# Altium project e-puck3-motor_dev.PrjPcb (part 1 of 2)
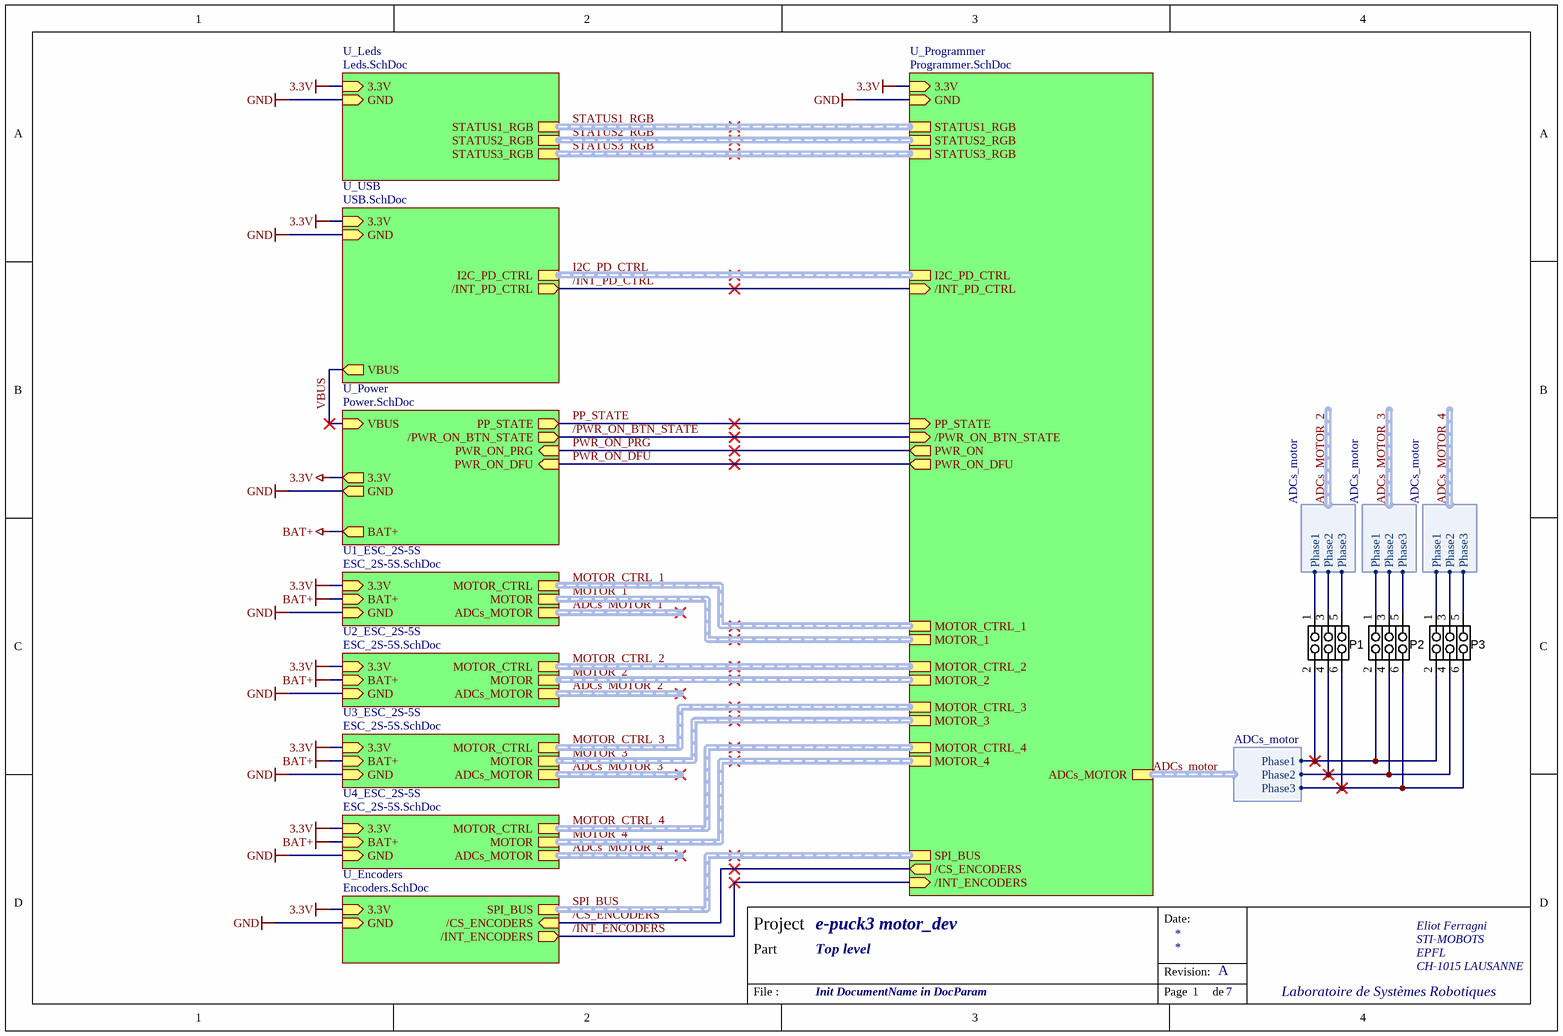
[diagram p0: Main.SchDoc]
Organization_Name: Laboratoire de Systèmes Robotiques; Project_Name: e-puck3 motor_dev; Project_Revision: 0.1
7 sheets, 196 parts. Net scope: strictly hierarchical (ports join the sheet entries above them; power ports are local).
Board file: motor_dev_pcb.PcbDoc
Sheets:
  Main.SchDoc
    U_Programmer = Programmer.SchDoc
    U_Power = Power.SchDoc
    U_USB = USB.SchDoc
    U_Leds = Leds.SchDoc
    U_Encoders = Encoders.SchDoc
    U1_ESC_2S-5S = ESC_2S-5S.SchDoc
    U2_ESC_2S-5S = ESC_2S-5S.SchDoc
    U3_ESC_2S-5S = ESC_2S-5S.SchDoc
    U4_ESC_2S-5S = ESC_2S-5S.SchDoc

## Sheet Main.SchDoc: Top level
size A4; Organization: Use Organization_Name in ProjParam; Address1: Eliot Ferragni; Address2: STI-MOBOTS; Address3: EPFL; Address4: CH-1015 LAUSANNE; DocumentNumber: 1; Revision: A; SheetNumber: 1; SheetTotal: 7; ApprovedBy: Init ApprovedBy in DocParam; CheckedBy: Init CheckedBy in DocParam; Author: Init Author in DocParam; CompanyName: Init CompanyName in DocParam; DrawnBy: Init DrawBy in DocParam; Engineer: Init Engineer in DocParam; DocumentName: Init DocumentName in DocParam; ProjectName: Init ProjectName in DocParam

### Parts
P1  Header 2x3 flat  [HEADER3x2-2.54]  (value not drawn)
P2  Header 2x3 flat  [HEADER3x2-2.54]  (value not drawn)
P3  Header 2x3 flat  [HEADER3x2-2.54]  (value not drawn)

### Sub-sheets
U1_ESC_2S-5S = ESC_2S-5S.SchDoc: MOTOR_CTRL (harness Brushless motor), BAT+ (in), GND (in), MOTOR (harness Motor_connection), ADCs_MOTOR (harness ADCs_motor), 3.3V (in)
U2_ESC_2S-5S = ESC_2S-5S.SchDoc: BAT+ (in), GND (in), 3.3V (in), MOTOR_CTRL (harness Brushless motor), MOTOR (harness Motor_connection), ADCs_MOTOR (harness ADCs_motor)
U3_ESC_2S-5S = ESC_2S-5S.SchDoc: BAT+ (in), GND (in), 3.3V (in), MOTOR_CTRL (harness Brushless motor), MOTOR (harness Motor_connection), ADCs_MOTOR (harness ADCs_motor)
U4_ESC_2S-5S = ESC_2S-5S.SchDoc: BAT+ (in), GND (in), 3.3V (in), MOTOR_CTRL (harness Brushless motor), MOTOR (harness Motor_connection), ADCs_MOTOR (harness ADCs_motor)
U_Encoders = Encoders.SchDoc: 3.3V (in), GND (in), SPI_BUS (harness SPI), /CS_ENCODERS (in), /INT_ENCODERS (out)
U_Leds = Leds.SchDoc: STATUS1_RGB (harness RGB), STATUS2_RGB (harness RGB), STATUS3_RGB (harness RGB), 3.3V (in), GND (in)
U_Power = Power.SchDoc: /PWR_ON_BTN_STATE (out), PP_STATE (out), VBUS (in), BAT+ (out), PWR_ON_DFU (in), PWR_ON_PRG (in), 3.3V (out), GND (out)
U_Programmer = Programmer.SchDoc: I2C_PD_CTRL (harness I2C), PP_STATE (in), /PWR_ON_BTN_STATE (in), PWR_ON (out), /INT_PD_CTRL (in), STATUS1_RGB (harness RGB), STATUS2_RGB (harness RGB), STATUS3_RGB (harness RGB), PWR_ON_DFU (out), 3.3V (in), GND (in), MOTOR_3 (harness Motor_connection), MOTOR_1 (harness Motor_connection), MOTOR_4 (harness Motor_connection), MOTOR_2 (harness Motor_connection), SPI_BUS (harness SPI), /CS_ENCODERS (out), /INT_ENCODERS (in), ADCs_MOTOR (harness ADCs_motor), MOTOR_CTRL_2 (harness Brushless motor), MOTOR_CTRL_1 (harness Brushless motor), MOTOR_CTRL_4 (harness Brushless motor), MOTOR_CTRL_3 (harness Brushless motor)
U_USB = USB.SchDoc: /INT_PD_CTRL (out), VBUS (out), I2C_PD_CTRL (harness I2C), 3.3V (in), GND (in)

### Harnesses
ADCs_motor: Phase1, Phase2, Phase3

### Nets
3.3V: sheet U_Programmer/3.3V, sheet U_Power/3.3V, sheet U_USB/3.3V, sheet U_Leds/3.3V, sheet U_Encoders/3.3V, sheet U1_ESC_2S-5S/3.3V, sheet U2_ESC_2S-5S/3.3V, sheet U3_ESC_2S-5S/3.3V, sheet U4_ESC_2S-5S/3.3V
BAT+: sheet U_Power/BAT+, sheet U1_ESC_2S-5S/BAT+, sheet U2_ESC_2S-5S/BAT+, sheet U3_ESC_2S-5S/BAT+, sheet U4_ESC_2S-5S/BAT+
GND: sheet U_Programmer/GND, sheet U_Power/GND, sheet U_USB/GND, sheet U_Leds/GND, sheet U_Encoders/GND, sheet U1_ESC_2S-5S/GND, sheet U2_ESC_2S-5S/GND, sheet U3_ESC_2S-5S/GND, sheet U4_ESC_2S-5S/GND
VBUS: sheet U_Power/VBUS, sheet U_USB/VBUS
/CS_ENCODERS: sheet U_Programmer//CS_ENCODERS, sheet U_Encoders//CS_ENCODERS
/INT_ENCODERS: sheet U_Programmer//INT_ENCODERS, sheet U_Encoders//INT_ENCODERS
/INT_PD_CTRL: sheet U_Programmer//INT_PD_CTRL, sheet U_USB//INT_PD_CTRL
/PWR_ON_BTN_STATE: sheet U_Programmer//PWR_ON_BTN_STATE, sheet U_Power//PWR_ON_BTN_STATE
ADCs_motor.Phase1: P1.2 P2.2 P3.2 ; sheet U_Programmer/ADCs_MOTOR.Phase1
ADCs_motor.Phase2: P1.4 P2.4 P3.4 ; sheet U_Programmer/ADCs_MOTOR.Phase2
ADCs_motor.Phase3: P1.6 P2.6 P3.6 ; sheet U_Programmer/ADCs_MOTOR.Phase3
ADCs_MOTOR_2.Phase1: P1.1 ; sheet U2_ESC_2S-5S/ADCs_MOTOR.Phase1
ADCs_MOTOR_2.Phase2: P1.3 ; sheet U2_ESC_2S-5S/ADCs_MOTOR.Phase2
ADCs_MOTOR_2.Phase3: P1.5 ; sheet U2_ESC_2S-5S/ADCs_MOTOR.Phase3
ADCs_MOTOR_3.Phase1: P2.1 ; sheet U3_ESC_2S-5S/ADCs_MOTOR.Phase1
ADCs_MOTOR_3.Phase2: P2.3 ; sheet U3_ESC_2S-5S/ADCs_MOTOR.Phase2
ADCs_MOTOR_3.Phase3: P2.5 ; sheet U3_ESC_2S-5S/ADCs_MOTOR.Phase3
ADCs_MOTOR_4.Phase1: P3.1 ; sheet U4_ESC_2S-5S/ADCs_MOTOR.Phase1
ADCs_MOTOR_4.Phase2: P3.3 ; sheet U4_ESC_2S-5S/ADCs_MOTOR.Phase2
ADCs_MOTOR_4.Phase3: P3.5 ; sheet U4_ESC_2S-5S/ADCs_MOTOR.Phase3
PP_STATE: sheet U_Programmer/PP_STATE, sheet U_Power/PP_STATE
PWR_ON_DFU: sheet U_Programmer/PWR_ON_DFU, sheet U_Power/PWR_ON_DFU
PWR_ON_PRG: sheet U_Programmer/PWR_ON, sheet U_Power/PWR_ON_PRG

### Buses and harness runs
harness ADCs_motor = sheet U_Programmer/ADCs_MOTOR
harness ADCs_MOTOR_1 = sheet U1_ESC_2S-5S/ADCs_MOTOR
harness ADCs_MOTOR_2 = sheet U2_ESC_2S-5S/ADCs_MOTOR
harness ADCs_MOTOR_3 = sheet U3_ESC_2S-5S/ADCs_MOTOR
harness ADCs_MOTOR_4 = sheet U4_ESC_2S-5S/ADCs_MOTOR
harness I2C_PD_CTRL = sheet U_Programmer/I2C_PD_CTRL = sheet U_USB/I2C_PD_CTRL
harness MOTOR_1 = sheet U1_ESC_2S-5S/MOTOR = sheet U_Programmer/MOTOR_1
harness MOTOR_2 = sheet U2_ESC_2S-5S/MOTOR = sheet U_Programmer/MOTOR_2
harness MOTOR_3 = sheet U3_ESC_2S-5S/MOTOR = sheet U_Programmer/MOTOR_3
harness MOTOR_4 = sheet U4_ESC_2S-5S/MOTOR = sheet U_Programmer/MOTOR_4
harness MOTOR_CTRL_1 = sheet U1_ESC_2S-5S/MOTOR_CTRL = sheet U_Programmer/MOTOR_CTRL_1
harness MOTOR_CTRL_2 = sheet U2_ESC_2S-5S/MOTOR_CTRL = sheet U_Programmer/MOTOR_CTRL_2
harness MOTOR_CTRL_3 = sheet U3_ESC_2S-5S/MOTOR_CTRL = sheet U_Programmer/MOTOR_CTRL_3
harness MOTOR_CTRL_4 = sheet U4_ESC_2S-5S/MOTOR_CTRL = sheet U_Programmer/MOTOR_CTRL_4
harness SPI_BUS = sheet U_Encoders/SPI_BUS = sheet U_Programmer/SPI_BUS
harness STATUS1_RGB = sheet U_Leds/STATUS1_RGB = sheet U_Programmer/STATUS1_RGB
harness STATUS2_RGB = sheet U_Leds/STATUS2_RGB = sheet U_Programmer/STATUS2_RGB
harness STATUS3_RGB = sheet U_Leds/STATUS3_RGB = sheet U_Programmer/STATUS3_RGB

### Notes on the sheet
- Date:
- Project
- Part
- Revision:
- File :
- Page
- de

### Library data of the parts
P1-P3 = Header 2x3 flat: LatestRevisionDate: 17-Jul-2002; LatestRevisionNote: Re-released for DXP Platform.; Publisher: Altium Limited

## Sheet Programmer.SchDoc: Programmer interface (STM32F746-Nucleo)
size A4; Organization: Use Organization_Name in ProjParam; Address1: Eliot Ferragni; Address2: STI-MOBOTS; Address3: EPFL; Address4: CH-1015 LAUSANNE; DocumentNumber: 5; Revision: A; SheetNumber: 5; SheetTotal: 7; ApprovedBy: Init ApprovedBy in DocParam; CheckedBy: Init CheckedBy in DocParam; Author: Init Author in DocParam; CompanyName: Init CompanyName in DocParam; DrawnBy: Init DrawBy in DocParam; Engineer: Init Engineer in DocParam; Title2: + Hall effect current sensors; DocumentName: Init DocumentName in DocParam; ProjectName: Init ProjectName in DocParam
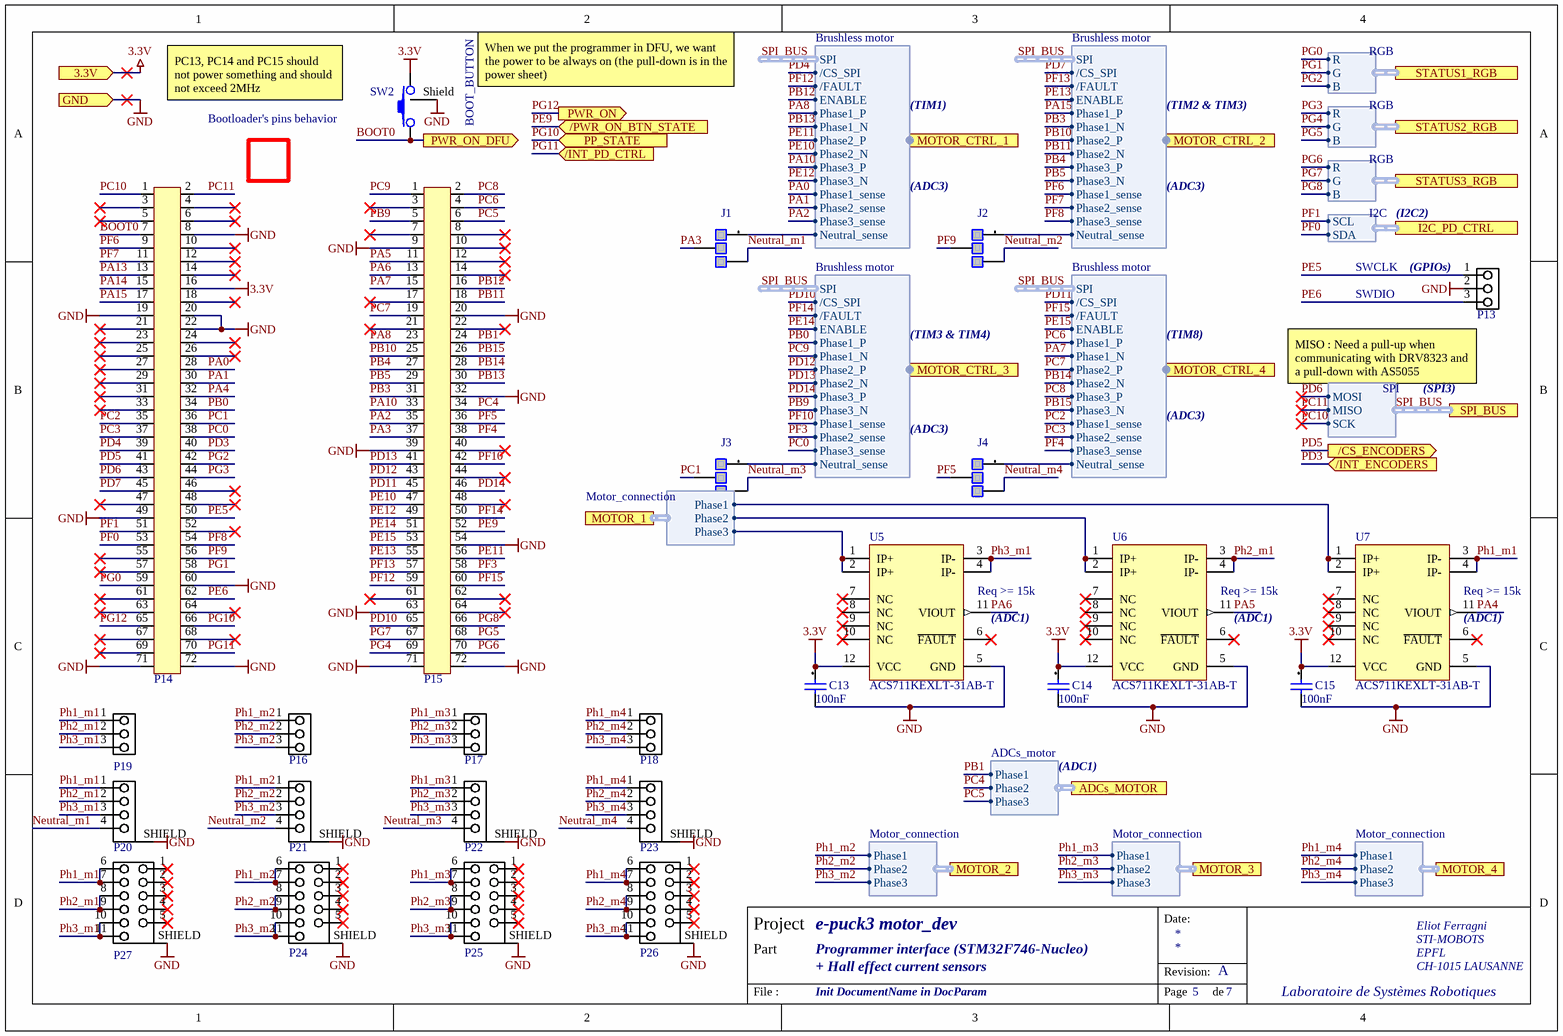
[diagram p1: Programmer.SchDoc]

### Parts
C13  100nF  [CAPC1608X08L]
C14  100nF  [CAPC1608X08L]
C15  100nF  [CAPC1608X08L]
J1  CC_SolderJP3_Micro  [CC_SolderJP3_U]  (value not drawn)  (no BOM)
J2  CC_SolderJP3_Micro  [CC_SolderJP3_U]  (value not drawn)  (no BOM)
J3  CC_SolderJP3_Micro  [CC_SolderJP3_U]  (value not drawn)  (no BOM)
J4  CC_SolderJP3_Micro  [CC_SolderJP3_U]  (value not drawn)  (no BOM)
P13  Header 3  [HEADER1X3-2.54]  (value not drawn)
P14  Header 2x36  [HEADER2x36-2.54]  (value not drawn)
P15  Header 2x36  [HEADER2x36-2.54]  (value not drawn)
P16  3 power pads  [PowerPads 3 pins]  (value not drawn)
P17  3 power pads  [PowerPads 3 pins]  (value not drawn)
P18  3 power pads  [PowerPads 3 pins]  (value not drawn)
P19  3 power pads  [PowerPads 3 pins]  (value not drawn)
P20  MOLEX-52207-0433  [Molex 52207-0433]  (value not drawn)
P21  MOLEX-52207-0433  [Molex 52207-0433]  (value not drawn)
P22  MOLEX-52207-0433  [Molex 52207-0433]  (value not drawn)
P23  MOLEX-52207-0433  [Molex 52207-0433]  (value not drawn)
P24  MOLEX-52207-1133  [Molex 52207-1133]  (value not drawn)
P25  MOLEX-52207-1133  [Molex 52207-1133]  (value not drawn)
P26  MOLEX-52207-1133  [Molex 52207-1133]  (value not drawn)
P27  MOLEX-52207-1133  [Molex 52207-1133]  (value not drawn)
SW2  button  [C&K_KMR2]  (value not drawn)
U5  ACS711KEXLT-31AB-T  [12-PowerWFQFN]
U6  ACS711KEXLT-31AB-T  [12-PowerWFQFN]
U7  ACS711KEXLT-31AB-T  [12-PowerWFQFN]

### Ports
3.3V (in), /CS_ENCODERS (out), /INT_ENCODERS (in), /INT_PD_CTRL (in), /PWR_ON_BTN_STATE (in), ADCs_MOTOR (harness ADCs_motor), GND (in), I2C_PD_CTRL (harness I2C), MOTOR_1 (harness Motor_connection), MOTOR_2 (harness Motor_connection), MOTOR_3 (harness Motor_connection), MOTOR_4 (harness Motor_connection), MOTOR_CTRL_1 (harness Brushless motor), MOTOR_CTRL_2 (harness Brushless motor), MOTOR_CTRL_3 (harness Brushless motor), MOTOR_CTRL_4 (harness Brushless motor), PP_STATE (in), PWR_ON (out), PWR_ON_DFU (out), SPI_BUS (harness SPI), STATUS1_RGB (harness RGB), STATUS2_RGB (harness RGB), STATUS3_RGB (harness RGB)

### Harnesses
RGB: R, G, B
I2C: SDA, SCL
Motor_connection: Phase1, Phase2, Phase3
SPI: MISO, MOSI, SCK
Brushless motor: Phase1_P, Phase1_N, Phase2_P, Phase2_N, Phase3_P, Phase3_N, Phase1_sense, Phase2_sense, Phase3_sense, Neutral_sense, /CS_SPI, SPI, ENABLE, /FAULT
ADCs_motor: Phase1, Phase2, Phase3

### Nets
3.3V: C13.1 C14.1 C15.1 P14.16 SW2.2 U5.12(VCC) U6.12(VCC) U7.12(VCC) ; port 3.3V
GND: C13.2 C14.2 C15.2 P13.2 P14.8 P14.19 P14.20 P14.22 P14.49 P14.60 P14.71 P14.72 P15.9 P15.20 P15.32 P15.39 P15.54 P15.63 P15.71 P15.72 P20.SHIELD P21.SHIELD P22.SHIELD P23.SHIELD P24.SHIELD P25.SHIELD P26.SHIELD P27.SHIELD SW2.Shield U5.5(GND) U6.5(GND) U7.5(GND) ; port GND
BOOT0: P14.7 SW2.1 ; port PWR_ON_DFU  [project net PWR_ON_DFU]
MOTOR_1.Phase1: U7.1(IP+) U7.2(IP+) ; port MOTOR_1.Phase1
MOTOR_1.Phase2: U6.1(IP+) U6.2(IP+) ; port MOTOR_1.Phase2
MOTOR_1.Phase3: U5.1(IP+) U5.2(IP+) ; port MOTOR_1.Phase3
MOTOR_CTRL_1.Neutral_sense: J1.1 ; port MOTOR_CTRL_1.Neutral_sense
MOTOR_CTRL_2.Neutral_sense: J2.1 ; port MOTOR_CTRL_2.Neutral_sense
MOTOR_CTRL_3.Neutral_sense: J3.1 ; port MOTOR_CTRL_3.Neutral_sense
MOTOR_CTRL_4.Neutral_sense: J4.1 ; port MOTOR_CTRL_4.Neutral_sense
Neutral_m1: J1.3 P20.4  [project net Neutral_m1_5]
Neutral_m2: J2.3 P21.4  [project net Neutral_m2_5]
Neutral_m3: J3.3 P22.4  [project net Neutral_m3_5]
Neutral_m4: J4.3 P23.4  [project net Neutral_m4_5]
PA0: P14.28 ; port MOTOR_CTRL_1.Phase1_sense  [project net MOTOR_CTRL_1.Phase1_sense]
PA1: P14.30 ; port MOTOR_CTRL_1.Phase2_sense  [project net MOTOR_CTRL_1.Phase2_sense]
PA2: P15.35 ; port MOTOR_CTRL_1.Phase3_sense  [project net MOTOR_CTRL_1.Phase3_sense]
PA3: J1.2 P15.37  [project net PA3_5]
PA4: P14.32 U7.11(VIOUT)  [project net PA4_5]
PA5: P15.11 U6.11(VIOUT)  [project net PA5_5]
PA6: P15.13 U5.11(VIOUT)  [project net PA6_5]
PA7: P15.15 ; port MOTOR_CTRL_4.Phase1_N  [project net MOTOR_CTRL_4.Phase1_N]
PA8: P15.23 ; port MOTOR_CTRL_1.Phase1_P  [project net MOTOR_CTRL_1.Phase1_P]
PA10: P15.33 ; port MOTOR_CTRL_1.Phase3_P  [project net MOTOR_CTRL_1.Phase3_P]
PA13: P14.13  [project net PA13_5]
PA14: P14.15  [project net PA14_5]
PA15: P14.17 ; port MOTOR_CTRL_2.Phase1_P  [project net MOTOR_CTRL_2.Phase1_P]
PB0: P14.34 ; port MOTOR_CTRL_3.Phase1_P  [project net MOTOR_CTRL_3.Phase1_P]
PB1: P15.24 ; port ADCs_MOTOR.Phase1  [project net ADCs_motor.Phase1]
PB3: P15.31 ; port MOTOR_CTRL_2.Phase1_N  [project net MOTOR_CTRL_2.Phase1_N]
PB4: P15.27 ; port MOTOR_CTRL_2.Phase3_P  [project net MOTOR_CTRL_2.Phase3_P]
PB5: P15.29 ; port MOTOR_CTRL_2.Phase3_N  [project net MOTOR_CTRL_2.Phase3_N]
PB9: P15.5 ; port MOTOR_CTRL_3.Phase3_N  [project net MOTOR_CTRL_3.Phase3_N]
PB10: P15.25 ; port MOTOR_CTRL_2.Phase2_P  [project net MOTOR_CTRL_2.Phase2_P]
PB11: P15.18 ; port MOTOR_CTRL_2.Phase2_N  [project net MOTOR_CTRL_2.Phase2_N]
PB12: P15.16 ; port MOTOR_CTRL_1.ENABLE  [project net MOTOR_CTRL_1.ENABLE]
PB13: P15.30 ; port MOTOR_CTRL_1.Phase1_N  [project net MOTOR_CTRL_1.Phase1_N]
PB14: P15.28 ; port MOTOR_CTRL_4.Phase2_N  [project net MOTOR_CTRL_4.Phase2_N]
PB15: P15.26 ; port MOTOR_CTRL_4.Phase3_N  [project net MOTOR_CTRL_4.Phase3_N]
PC0: P14.38 ; port MOTOR_CTRL_3.Phase3_sense  [project net MOTOR_CTRL_3.Phase3_sense]
PC1: J3.2 P14.36  [project net PC1_5]
PC2: P14.35 ; port MOTOR_CTRL_4.Phase1_sense  [project net MOTOR_CTRL_4.Phase1_sense]
PC3: P14.37 ; port MOTOR_CTRL_4.Phase2_sense  [project net MOTOR_CTRL_4.Phase2_sense]
PC4: P15.34 ; port ADCs_MOTOR.Phase2  [project net ADCs_motor.Phase2]
PC5: P15.6 ; port ADCs_MOTOR.Phase3  [project net ADCs_motor.Phase3]
PC6: P15.4 ; port MOTOR_CTRL_4.Phase1_P  [project net MOTOR_CTRL_4.Phase1_P]
PC7: P15.19 ; port MOTOR_CTRL_4.Phase2_P  [project net MOTOR_CTRL_4.Phase2_P]
PC8: P15.2 ; port MOTOR_CTRL_4.Phase3_P  [project net MOTOR_CTRL_4.Phase3_P]
PC9: P15.1 ; port MOTOR_CTRL_3.Phase1_N  [project net MOTOR_CTRL_3.Phase1_N]
PC10: P14.1 ; port SPI_BUS.SCK  [project net SPI_BUS.SCK]
PC11: P14.2 ; port SPI_BUS.MISO  [project net SPI_BUS.MISO]
PD3: P14.40 ; port /INT_ENCODERS  [project net /INT_ENCODERS]
PD4: P14.39 ; port MOTOR_CTRL_1./CS_SPI  [project net MOTOR_CTRL_1./CS_SPI]
PD5: P14.41 ; port /CS_ENCODERS  [project net /CS_ENCODERS]
PD6: P14.43 ; port SPI_BUS.MOSI  [project net SPI_BUS.MOSI]
PD7: P14.45 ; port MOTOR_CTRL_2./CS_SPI  [project net MOTOR_CTRL_2./CS_SPI]
PD10: P15.65 ; port MOTOR_CTRL_3./CS_SPI  [project net MOTOR_CTRL_3./CS_SPI]
PD11: P15.45 ; port MOTOR_CTRL_4./CS_SPI  [project net MOTOR_CTRL_4./CS_SPI]
PD12: P15.43 ; port MOTOR_CTRL_3.Phase2_P  [project net MOTOR_CTRL_3.Phase2_P]
PD13: P15.41 ; port MOTOR_CTRL_3.Phase2_N  [project net MOTOR_CTRL_3.Phase2_N]
PD14: P15.46 ; port MOTOR_CTRL_3.Phase3_P  [project net MOTOR_CTRL_3.Phase3_P]
PE5: P13.1 P14.50  [project net PE5_5]
PE6: P13.3 P14.62  [project net PE6_5]
PE9: P15.52 ; port /PWR_ON_BTN_STATE  [project net /PWR_ON_BTN_STATE]
PE10: P15.47 ; port MOTOR_CTRL_1.Phase2_N  [project net MOTOR_CTRL_1.Phase2_N]
PE11: P15.56 ; port MOTOR_CTRL_1.Phase2_P  [project net MOTOR_CTRL_1.Phase2_P]
PE12: P15.49 ; port MOTOR_CTRL_1.Phase3_N  [project net MOTOR_CTRL_1.Phase3_N]
PE13: P15.55 ; port MOTOR_CTRL_2.ENABLE  [project net MOTOR_CTRL_2.ENABLE]
PE14: P15.51 ; port MOTOR_CTRL_3.ENABLE  [project net MOTOR_CTRL_3.ENABLE]
PE15: P15.53 ; port MOTOR_CTRL_4.ENABLE  [project net MOTOR_CTRL_4.ENABLE]
PF0: P14.53 ; port I2C_PD_CTRL.SDA  [project net I2C_PD_CTRL.SDA]
PF1: P14.51 ; port I2C_PD_CTRL.SCL  [project net I2C_PD_CTRL.SCL]
PF3: P15.58 ; port MOTOR_CTRL_3.Phase2_sense  [project net MOTOR_CTRL_3.Phase2_sense]
PF4: P15.38 ; port MOTOR_CTRL_4.Phase3_sense  [project net MOTOR_CTRL_4.Phase3_sense]
PF5: J4.2 P15.36  [project net PF5_5]
PF6: P14.9 ; port MOTOR_CTRL_2.Phase1_sense  [project net MOTOR_CTRL_2.Phase1_sense]
PF7: P14.11 ; port MOTOR_CTRL_2.Phase2_sense  [project net MOTOR_CTRL_2.Phase2_sense]
PF8: P14.54 ; port MOTOR_CTRL_2.Phase3_sense  [project net MOTOR_CTRL_2.Phase3_sense]
PF9: J2.2 P14.56  [project net PF9_5]
PF10: P15.42 ; port MOTOR_CTRL_3.Phase1_sense  [project net MOTOR_CTRL_3.Phase1_sense]
PF12: P15.59 ; port MOTOR_CTRL_1./FAULT  [project net MOTOR_CTRL_1./FAULT]
PF13: P15.57 ; port MOTOR_CTRL_2./FAULT  [project net MOTOR_CTRL_2./FAULT]
PF14: P15.50 ; port MOTOR_CTRL_3./FAULT  [project net MOTOR_CTRL_3./FAULT]
PF15: P15.60 ; port MOTOR_CTRL_4./FAULT  [project net MOTOR_CTRL_4./FAULT]
PG0: P14.59 ; port STATUS1_RGB.R  [project net STATUS1_RGB.R]
PG1: P14.58 ; port STATUS1_RGB.G  [project net STATUS1_RGB.G]
PG2: P14.42 ; port STATUS1_RGB.B  [project net STATUS1_RGB.B]
PG3: P14.44 ; port STATUS2_RGB.R  [project net STATUS2_RGB.R]
PG4: P15.69 ; port STATUS2_RGB.G  [project net STATUS2_RGB.G]
PG5: P15.68 ; port STATUS2_RGB.B  [project net STATUS2_RGB.B]
PG6: P15.70 ; port STATUS3_RGB.R  [project net STATUS3_RGB.R]
PG7: P15.67 ; port STATUS3_RGB.G  [project net STATUS3_RGB.G]
PG8: P15.66 ; port STATUS3_RGB.B  [project net STATUS3_RGB.B]
PG10: P14.66 ; port PP_STATE  [project net PP_STATE]
PG11: P14.70 ; port /INT_PD_CTRL  [project net /INT_PD_CTRL]
PG12: P14.65 ; port PWR_ON  [project net PWR_ON_PRG]
Ph1_m1: P19.1 P20.1 P27.6 P27.7 U7.3(IP-) U7.4(IP-)  [project net Ph1_m1_5]
Ph1_m2: P16.1 P21.1 P24.6 P24.7 ; port MOTOR_2.Phase1  [project net MOTOR_2.Phase1]
Ph1_m3: P17.1 P22.1 P25.6 P25.7 ; port MOTOR_3.Phase1  [project net MOTOR_3.Phase1]
Ph1_m4: P18.1 P23.1 P26.6 P26.7 ; port MOTOR_4.Phase1  [project net MOTOR_4.Phase1]
Ph2_m1: P19.2 P20.2 P27.8 P27.9 U6.3(IP-) U6.4(IP-)  [project net Ph2_m1_5]
Ph2_m2: P16.2 P21.2 P24.8 P24.9 ; port MOTOR_2.Phase2  [project net MOTOR_2.Phase2]
Ph2_m3: P17.2 P22.2 P25.8 P25.9 ; port MOTOR_3.Phase2  [project net MOTOR_3.Phase2]
Ph2_m4: P18.2 P23.2 P26.8 P26.9 ; port MOTOR_4.Phase2  [project net MOTOR_4.Phase2]
Ph3_m1: P19.3 P20.3 P27.10 P27.11 U5.3(IP-) U5.4(IP-)  [project net Ph3_m1_5]
Ph3_m2: P16.3 P21.3 P24.10 P24.11 ; port MOTOR_2.Phase3  [project net MOTOR_2.Phase3]
Ph3_m3: P17.3 P22.3 P25.10 P25.11 ; port MOTOR_3.Phase3  [project net MOTOR_3.Phase3]
Ph3_m4: P18.3 P23.3 P26.10 P26.11 ; port MOTOR_4.Phase3  [project net MOTOR_4.Phase3]

Not connected (* = marked no-connect by the designer): P14 3* 4* 5* 6* 10* 12* 14* 18* 21* 23* 24* 25* 26* 27* 29* 31* 33* 46* 47* 48* 52(51)* 55(52)* 57(53)* 61(55)* 63(56)* 64(57)* 67(58)* 68(59)* 69(59)*; P15 3* 7* 8* 10* 12* 14* 17* 21* 22* 40* 44* 48* 61(55)* 62(56)* 64(57)*; P24 1* 2* 3* 4* 5*; P25 1* 2* 3* 4* 5*; P26 1* 2* 3* 4* 5*; P27 1* 2* 3* 4* 5*; U5 6(~{FAULT})* 7(NC)* 8(NC)* 9(NC)* 10(NC)*; U6 6(~{FAULT})* 7(NC)* 8(NC)* 9(NC)* 10(NC)*; U7 6(~{FAULT})* 7(NC)* 8(NC)* 9(NC)* 10(NC)*

### Buses and harness runs
harness SPI_BUS = port SPI_BUS

### Notes on the sheet
- PC13, PC14 and PC15 should not power something and should not exceed 2MHz
- When we put the programmer in DFU, we want the power to be always on (the pull-down is in the power sheet)
- (TIM1)
- (TIM2 & TIM3)
- (near SW2) Bootloader's pins behavior
- BOOT_BUTTON
- (near J2) (ADC3)
- (ADC3)
- (I2C2)
- SWCLK
- SWDIO
- (near P13) (GPIOs)
- (TIM3 & TIM4)
- (TIM8)
- (near P13) MISO : Need a pull-up when communicating with DRV8323 and a pull-down with AS5055
- (near J4) (ADC3)
- (SPI3)
- Bootloader's pins behavior :
  USART1 :
  PA10 (RX) set as input 	-> connected to Phase3_P motor1 with pull-down				=> OK
  PA9 (TX) set as output high	-> connected to VBus							=> OK
  USART3:
  PB11 (RX) set as input	-> connected to Phase2_N motor2 with pull-down				=> OK
  PB10 (TX) set as output high	-> connected to Phase2_P motor2 with pull-down				=> not really a problem because all other transistors of this motor are OFF
  PC11 (RX) set as input	-> connected to MISO SPI_ENCODERS					=> OK
  PC10 (TX) set as output high	-> connected to SCK of SPI_ENCODERS					=> OK
  CAN2 (slave):
  PB5 (RX) set as input		-> connected to Phase3_N motor2 with pull-down				=> OK
  PB13 (TX) set as output high	-> connected to Phase1_N motor1 with pull-down				=> not really a problem because all other transistors of this motor are OFF
  I2C1 (slave):
  PB6 (SCL) set as open-drain	-> not connected							=> OK
  PB9 (SDA) set as open-drain	-> connected to Phase3_N with pull-down					=> OK
  I2C2 (slave):
  PF1 (SCL) set as open-drain	-> connected to SCL of I2C_pd_controller with pull-up				=> OK
  PF0 (SDA) set as open-drain	-> connected to SDA of I2C_pd_controller with pull-up				=> OK
  I2C3 (slave):
  PA8 (SCL) set as open-drain	-> connected to Phase1_P motor1 with pull-down				=> OK
  PC9 (SDA) set as open-drain	-> connected to Phase1_N motor3 with pull-down				=> OK
  USB (DFU):
  PA11 (DM)		-> connected to USB connector on the Nucleo Board				=> OK
  PA12 (DP) (no pull-up needed)	-> connected to USB connector on the Nucleo Board				=> OK
- (near U5) Req >= 15k
- (near U5) (ADC1)
- (near U6) Req >= 15k
- (near U6) (ADC1)
- (near U7) Req >= 15k
- (near U7) (ADC1)
- (ADC1)
- Date:
- Project
- Part
- Revision:
- File :
- Page
- de

### Library data of the parts
C13-C15 = TBD Capacitor[[/\]]0603[[/\]]1: Capacitor TBD 0603; Preference: 1; Currentie: CHF; Size: 0603; Footprint Acort: 0603_G; ROHS: True; DateLastUpdate: 2012-11-19 / 14:36:40
J1-J4 = CC_SolderJP3_Micro: Micro Solder Jumper 3 leads; Preference: 1; Footprint Acort: ToDefine; DateLastUpdate: 2008-02-26 / 09:57:0
P13 = Header 3: Header, 3-Pin; Manufacturer: Generic Components; Class I: Connector; Revision: July-2002: Re-released for DXP Platform.; Publisher: Altium Limited
P16-P19 = 3 power pads: 3-Pin; Manufacturer: Generic Components; Class I: Connector; Revision: July-2002: Re-released for DXP Platform.; Publisher: Altium Limited
SW2 = C&K KMR2: KMR221GLFS; Manufacturer: Tyco; Manufacturer Nr: 7-188275-6; Preference: 1; Currentie: CHF; Quant_1: 10; Quant_2: 900; Circuit: SPST-NO; Switch Function: Off-Mom; Contact Rating @ Voltage: 0.05A @ 32VDC; Actuator Type: Standard; Actuator Height off PCB, from Pins: 1.90mm; Actuator Orientation: Top Actuated; Outline: 4.60mm x 2.80mm; Illumination: Non-Illuminated; Operating Force: 200gf; Switch Travel: 0.25mm; Mechanical Life: 200,000 Cycles; Footprint Acort: ToDefine; ComponentLink1Description: Datasheet; ComponentLink1URL: http://ecommas.tycoelectronics.com/commerce/DocumentDelivery/DDEController?Action=showdoc&DocId=Customer+Drawing%7F188275%7FR%7Fpdf%7FEnglish%7FC_188275_R.pdf; Supplier: Farnell; Supplier Nr: 1056234; ComponentLink2Description: Farnell link; ComponentLink2URL: http://fr.farnell.com/jsp/displayProduct.jsp?sku=1056234; ROHS: True; Type: SMD; Orientation: Vertical; DateLastUpdate: 2007-12-04 / 09:15:57; Price_1: 1,1; Price_2: 0,924; Supplier 1: Digi-Key; Manufacturer Part Number: KMR221GLFS; Category: Switches; Stock 1: 20549; Pricing 1: 1=0.51, 10=0.493, 25=0.484, 50=0.4656, 100=0.4017, 250=0.3652, 500=0.34694, 1000=0.2739 (USD); Packaging: Cut Tape (CT); Mounting Type: Surface Mount; Termination Style: Gull Wing; Illumination Voltage (Nominal): -; Illumination Type, Color: -; Ingress Protection: -; Features: Grounding Pin; Actuator Material: -; Operating Temperature: -40°C ~ 85°C; ComponentLink3URL: http://www.ck-components.com/index.php?module=media&action=Display&cmpref=14414&lang=en&width=&height=&format=&alt=; ComponentLink3Description: http://www.ck-components.com/index.php?module=media&action=Display&cmpref=14414&lang=en&width=&height=&format=&alt=; Supplier Part Number 1: 401-1427-1-ND
U5-U7 = ACS711KEXLT-31AB-T: Hall Effect Linear Current Sensor with Overcurrent Fault Output for <100 V Isolation Applications, 3 to 5.5 V, -31 to 31 A IP, -40 to 125 degC, 12-Pin QFN (EX), RoHS, Tape and Reel; VCC Max: 5.5 V; IP Max: 31A; VCC Min: 3 V; IP Min: -31 A; -3dB Bandwidth: 0.1 MHz; PackageDescription: 12-Pin Quad Flat No-Lead, Body 3 x 3 mm, Height 0.8 mm; ComponentLink1URL: http://www.allegromicro.com/; Packing: Tape and Reel; ComponentLink2URL: http://www.allegromicro.com/~/media/Files/Datasheets/ACS711-Datasheet.ashx?la=en; DatasheetVersion: Rev. 4; PartNumber: ACS711KEXLT-31AB-T; ComponentLink2Description: Datasheet; ComponentLink3URL: http://www.allegromicro.com/~/media/Files/Datasheets/ACS711-Datasheet.ashx?la=en; RoHS: TRUE; ComponentLink1Description: Manufacturer URL; ComponentLink3Description: Package Specification; Temperature Max: 125 degC; Mounting Technology: Surface Mount; Temperature Min: -40 degC

## Sheet Power.SchDoc: Power
size A4; Organization: Use Organization_Name in ProjParam; Address1: Eliot Ferragni; Address2: STI-MOBOTS; Address3: EPFL; Address4: CH-1015 LAUSANNE; DocumentNumber: 4; Revision: A; SheetNumber: 4; SheetTotal: 7; ApprovedBy: Init ApprovedBy in DocParam; CheckedBy: Init CheckedBy in DocParam; Author: Init Author in DocParam; CompanyName: Init CompanyName in DocParam; DrawnBy: Init DrawBy in DocParam; Engineer: Init Engineer in DocParam; DocumentName: Init DocumentName in DocParam; ProjectName: Init ProjectName in DocParam
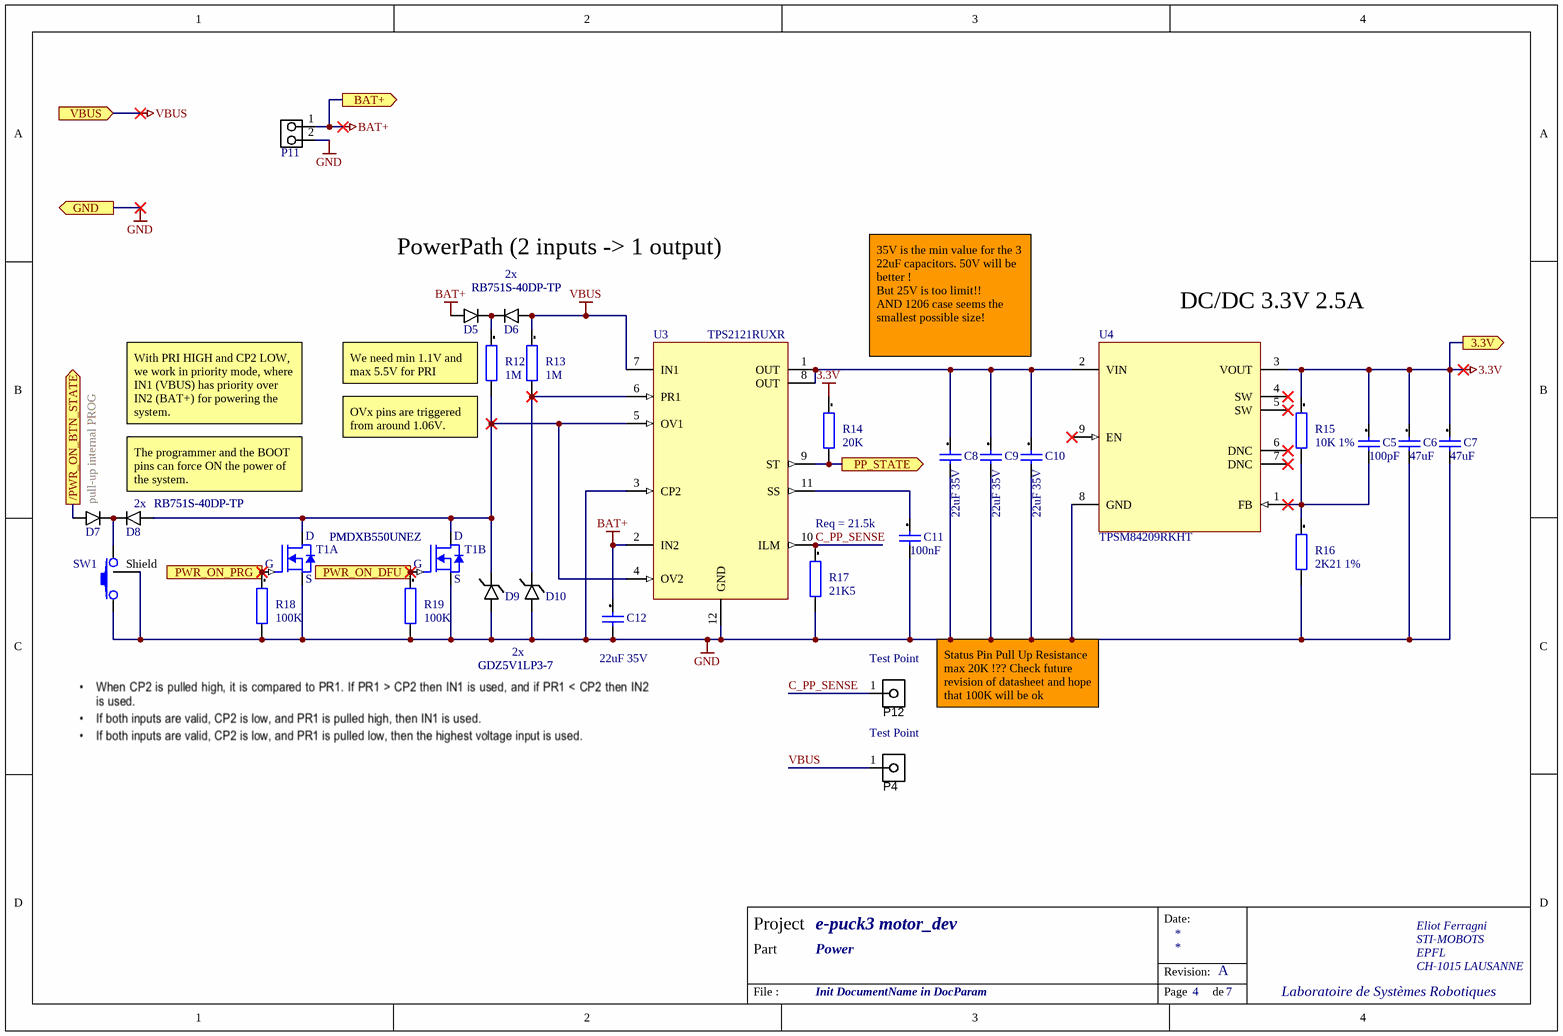
[diagram p2: Power.SchDoc]

### Parts
C5  100pF  [CAPC1608X08L]
C6  47uF  [CAPC1608X08L]
C7  47uF  [CAPC1608X08L]
C8  22uF 35V  [CAPC3216X17L]
C9  22uF 35V  [CAPC3216X17L]
C10  22uF 35V  [CAPC3216X17L]
C11  100nF  [CAPC1608X08L]
C12  22uF 35V  [CAPC3216X17L]
D5  RB751S-40DP-TP  [0201 diode - Wide]
D6  RB751S-40DP-TP  [0201 diode - Wide]
D7  RB751S-40DP-TP  [0201 diode - Wide]
D8  RB751S-40DP-TP  [0201 diode - Wide]
D9  GDZ5V1LP3-7  [0201 diode - Wide]
D10  GDZ5V1LP3-7  [0201 diode - Wide]
P4  Header 1  [HEADER1x1-2.54]  (value not drawn)
P11  2 power pads  [PowerPads 2 pins]  (value not drawn)
P12  Header 1  [HEADER1x1-2.54]  (value not drawn)
R12  1M  [RESC1608X06N]
R13  1M  [RESC1608X06N]
R14  20K  [RESC1608X06N]
R15  10K 1%  [RESC1608X06N]
R16  2K21 1%  [RESC1608X06N]
R17  21K5  [RESC1608X06N]
R18  100K  [RESC1608X06N]
R19  100K  [RESC1608X06N]
SW1  button  [C&K_KMR2]  (value not drawn)
T1  PMDXB550UNEZ  [DFN1010B-6]  (parts A,B of 2)
U3  TPS2121RUXR  [VQFN-HR (RUX) 12]
U4  TPSM84209RKHT  [QFN-FCMOD (RKH) 9]

### Ports
3.3V (out), /PWR_ON_BTN_STATE (out), BAT+ (out), GND (out), PP_STATE (out), PWR_ON_DFU (in), PWR_ON_PRG (in), VBUS (in)

### Nets
3.3V: C5.1 C6.1 C7.1 R14.1 R15.1 U4.3(VOUT) ; port 3.3V
BAT+: C12.1 D5.2(C) P11.1 U3.2(IN2) ; port BAT+
GND: C6.2 C7.2 C8.2 C9.2 C10.2 C11.2 C12.2 D9.2(C) D10.2(C) P11.2 R16.2 R17.2 R18.2 R19.2 SW1.1 SW1.Shield T1.1(S) T1.4(S) U3.3(CP2) U3.12(GND) U4.8(GND) ; port GND
VBUS: D6.2(C) P4.1 R13.1 U3.7(IN1) ; port VBUS
/PWR_ON_BTN_STATE: D7.2(C) ; port /PWR_ON_BTN_STATE
C_PP_SENSE: P12.1 R17.1 U3.10(ILM)  [project net C_PP_SENSE_4]
PP_STATE: R14.2 U3.9(ST) ; port PP_STATE
PWR_ON_DFU: R19.1 T1.5(G) ; port PWR_ON_DFU
PWR_ON_PRG: R18.1 T1.2(G) ; port PWR_ON_PRG
NetC5_2: C5.2 R15.2 R16.1 U4.1(FB)
NetC8_1: C8.1 C9.1 C10.1 U3.1(OUT) U3.8(OUT) U4.2(VIN)
NetC11_1: C11.1 U3.11(SS)
NetD5_1: D5.1(C) D6.1(C) R12.1
NetD7_1: D7.1(C) D8.1(C) SW1.2
NetD8_2: D8.2(C) D9.1(C) R12.2 T1.3(D) T1.6(D) U3.4(OV2) U3.5(OV1)
NetD10_1: D10.1(C) R13.2 U3.6(PR1)

Not connected (* = marked no-connect by the designer): U4 4(SW)* 5(SW)* 6(DNC)* 7(DNC)* 9(EN)*

### Notes on the sheet
- PowerPath (2 inputs -> 1 output)
- 2x
- DC/DC 3.3V 2.5A
- (near R12) We need min 1.1V and max 5.5V for PRI
- 35V is the min value for the 3 22uF capacitors. 50V will be better !
  But 25V is too limit!!
  AND 1206 case seems the smallest possible size!
- With PRI HIGH and CP2 LOW, we work in priority mode, where IN1 (VBUS) has priority over IN2 (BAT+) for powering the system.
- (near R12) OVx pins are triggered from around 1.06V.
- (near D7) pull-up internal PROG
- The programmer and the BOOT pins can force ON the power of the system.
- (near D8) 2x
- Req = 21.5k
- (near P12) Test Point
- (near P12) Status Pin Pull Up Resistance max 20K !?? Check future revision of datasheet and hope that 100K will be ok
- Test Point
- Date:
- Project
- Part
- Revision:
- File :
- Page
- de

### Library data of the parts
C5-C7 C11 = TBD Capacitor[[/\]]0603[[/\]]1: as C13 on sheet Programmer; Size: 0603; Footprint Acort: 0603_G; ROHS: True; DateLastUpdate: 2012-11-19 / 14:36:40
C8-C10 C12 = TBD Capacitor[[/\]]1206[[/\]]1: Capacitor TBD 1206; Preference: 1; Currentie: CHF; Size: 1206; Footprint Acort: 1206; ROHS: True; DateLastUpdate: 2012-11-19 / 14:37:26
D5-D8 = RB751S-40DP-TP: Schottky Diodes & Rectifiers 203 Package Schottky Diodes; Manufacturer: MCC; Reverse Voltage (DC): 28V; Average Rectified Current: 30mA; Element Configuration: Single; Forward Current: 200mA; Max Repetitive Reverse Voltage (Vrrm): 40V; Peak Reverse Current: 500nA; Max Power Dissipation: 100mW; Supplier 1: Digi-Key; Manufacturer Part Number: RB751S-40DP-TP; Stock 1: 104704; Pricing 1: 1=0.3, 10=0.27, 100=0.1514, 500=0.08112, 1000=0.05516 (USD); Mount: Surface Mount; Case/Package: 0201; Case Code (Metric): 0603; Case Code (Imperial): 0201; Max Operating Temperature: 125°C; Packaging: Tape and Reel; Termination: SMD/SMT; Max Forward Surge Current (Ifsm): 200mA; Package Quantity: 10000; Max Reverse Voltage (DC): 40V; Length: 0.67mm; Height: 0.34mm; Width: 0.37mm; Supplier Part Number 1: RB751S-40DP-TPMSCT-ND
D9 D10 = GDZ5V1LP3-7: DIODE ZENER 5.1V 250MW 2DFN; Manufacturer: Diodes; Tolerance: 5%; Max Reverse Leakage Current: 200nA; Element Configuration: Single; Supplier 1: Digi-Key; Manufacturer Part Number: GDZ5V1LP3-7; Stock 1: 50190; Pricing 1: 1=0.37, 10=0.303, 100=0.1607, 500=0.1057, 1000=0.07188 (USD); Mount: Surface Mount; Case/Package: DFN; Number of Pins: 2; Min Operating Temperature: -55°C; Max Operating Temperature: 150°C; Packaging: Tape and Reel; Max Power Dissipation: 250mW; Package Quantity: 10000; Zener Voltage: 5.1V; Zener Current: 200nA; Voltage Tolerance: 5%; Peak Reverse Current: 200nA; Power Rating: 250mW; Length: 0.62mm; Height: 0.3mm; Width: 0.32mm; Radiation Hardening: No; REACH SVHC: No SVHC; ComponentLink1URL: https://www.diodes.com/assets/Datasheets/GDZxVxLP3.pdf; ComponentLink1Description: https://www.diodes.com/assets/Datasheets/GDZxVxLP3.pdf; Supplier Part Number 1: GDZ5V1LP3-7DICT-ND
P11 = 2 power pads: 2-Pin; Manufacturer: Generic Components; Class I: Connector; Revision: July-2002: Re-released for DXP Platform.; Publisher: Altium Limited
R12-R19 = TBD[[/\]]0603[[/\]]1: Resistor ToDo 0603; Preference: 1; Currentie: CHF; Size: 0603; Footprint Acort: 0603; ROHS: True; DateLastUpdate: 2012-11-19 / 14:13:33
SW1 = C&K KMR2: as SW2 on sheet Programmer; Footprint Acort: ToDefine; ComponentLink1Description: Datasheet; ComponentLink1URL: http://ecommas.tycoelectronics.com/commerce/DocumentDelivery/DDEController?Action=showdoc&DocId=Customer+Drawing%7F188275%7FR%7Fpdf%7FEnglish%7FC_188275_R.pdf; Supplier: Farnell; Supplier Nr: 1056234; ComponentLink2Description: Farnell link; ComponentLink2URL: http://fr.farnell.com/jsp/displayProduct.jsp?sku=1056234; ROHS: True; Type: SMD; Orientation: Vertical; DateLastUpdate: 2007-12-04 / 09:15:57; Price_1: 1,1; Price_2: 0,924; Supplier 1: Digi-Key; Manufacturer Part Number: KMR221GLFS; Category: Switches; Stock 1: 20549; Pricing 1: 1=0.51, 10=0.493, 25=0.484, 50=0.4656, 100=0.4017, 250=0.3652, 500=0.34694, 1000=0.2739 (USD); Packaging: Cut Tape (CT); Mounting Type: Surface Mount; Termination Style: Gull Wing; Illumination Voltage (Nominal): -; Illumination Type, Color: -; Ingress Protection: -; Features: Grounding Pin; Actuator Material: -; Operating Temperature: -40°C ~ 85°C; ComponentLink3URL: http://www.ck-components.com/index.php?module=media&action=Display&cmpref=14414&lang=en&width=&height=&format=&alt=; ComponentLink3Description: http://www.ck-components.com/index.php?module=media&action=Display&cmpref=14414&lang=en&width=&height=&format=&alt=; Supplier Part Number 1: 401-1427-1-ND
T1 = PMDXB550UNEZ: DUAL N-CHANNEL 30V; Manufacturer: NXP Semiconductors; Continuous Drain Current (ID): 590mA; Max Power Dissipation: 285mW; Rds On Max: 670mR; Input Capacitance: 30.3pF; FET Type: 2 N-Channel; Supplier 1: Digi-Key; Stock 1: 5582; Pricing 1: 1=0.48, 10=0.379, 100=0.2601, 500=0.17838, 1000=0.13379 (USD); Mount: Surface Mount; Min Operating Temperature: -55°C; Max Operating Temperature: 150°C; Drain to Source Voltage (Vdss): 30V; Packaging: Tape and Reel; Supplier Part Number 1: 1727-2277-1-ND; Manufacturer Part Number: PMDXB550UNEZ
U3 = TPS2121RUXR: Power Mux Dual Input One Output; Manufacturer: Texas Instruments; PartNumber: TPS2121RUXR; RefDes: RefDes; Type: DEV; Value: Value
U4 = TPSM84209RKHT: DC DC CONVERTER 1.2-6V 15W; Manufacturer: Texas Instruments; Voltage - Input (Min): 4.5V; Voltage - Input (Max): 28V; Voltage - Output 1: 1.2 ~ 6 V; Current - Output (Max): 2.5A; Efficiency: 86.5%; Supplier 1: Digi-Key; Manufacturer Part Number: TPSM84209RKHT; RoHS: Request Inventory Verification; Category: Power Supplies - Board Mount; Stock 1: 47; Pricing 1: 1=5.04, 10=4.53, 100=3.7117 (USD); Packaging: Cut Tape (CT); Part Status: Active; Type: Non-Isolated PoL Module; Voltage - Output 2: -; Voltage - Output 3: -; Voltage - Output 4: -; Applications: ITE (Commercial); Features: OCP, OTP, UVLO; Operating Temperature: -40°C ~ 85°C (With Derating); Mounting Type: Surface Mount; Package / Case: 9-PowerQFN; Size / Dimension: 0.18" L x 0.16" W x 0.08" H (4.5mm x 4.0mm x 2.1mm); Supplier Device Package: 9-QFN-FCMOD (4.5x4); ComponentLink1URL: http://www.ti.com/lit/ds/symlink/tpsm84209.pdf; ComponentLink1Description: http://www.ti.com/lit/ds/symlink/tpsm84209.pdf
P4 P12 = Header 1: LatestRevisionDate: 17-Jul-2002; LatestRevisionNote: Re-released for DXP Platform.; Publisher: Altium Limited

## Sheet USB.SchDoc: USB
size A4; Organization: Use Organization_Name in ProjParam; Address1: Eliot Ferragni; Address2: STI-MOBOTS; Address3: EPFL; Address4: CH-1015 LAUSANNE; DocumentNumber: 3; Revision: A; SheetNumber: 3; SheetTotal: 7; ApprovedBy: Init ApprovedBy in DocParam; CheckedBy: Init CheckedBy in DocParam; Author: Init Author in DocParam; CompanyName: Init CompanyName in DocParam; DrawnBy: Init DrawBy in DocParam; Engineer: Init Engineer in DocParam; Title2: USB-C connector, ESD protections and PD controller; DocumentName: Init DocumentName in DocParam; ProjectName: Init ProjectName in DocParam
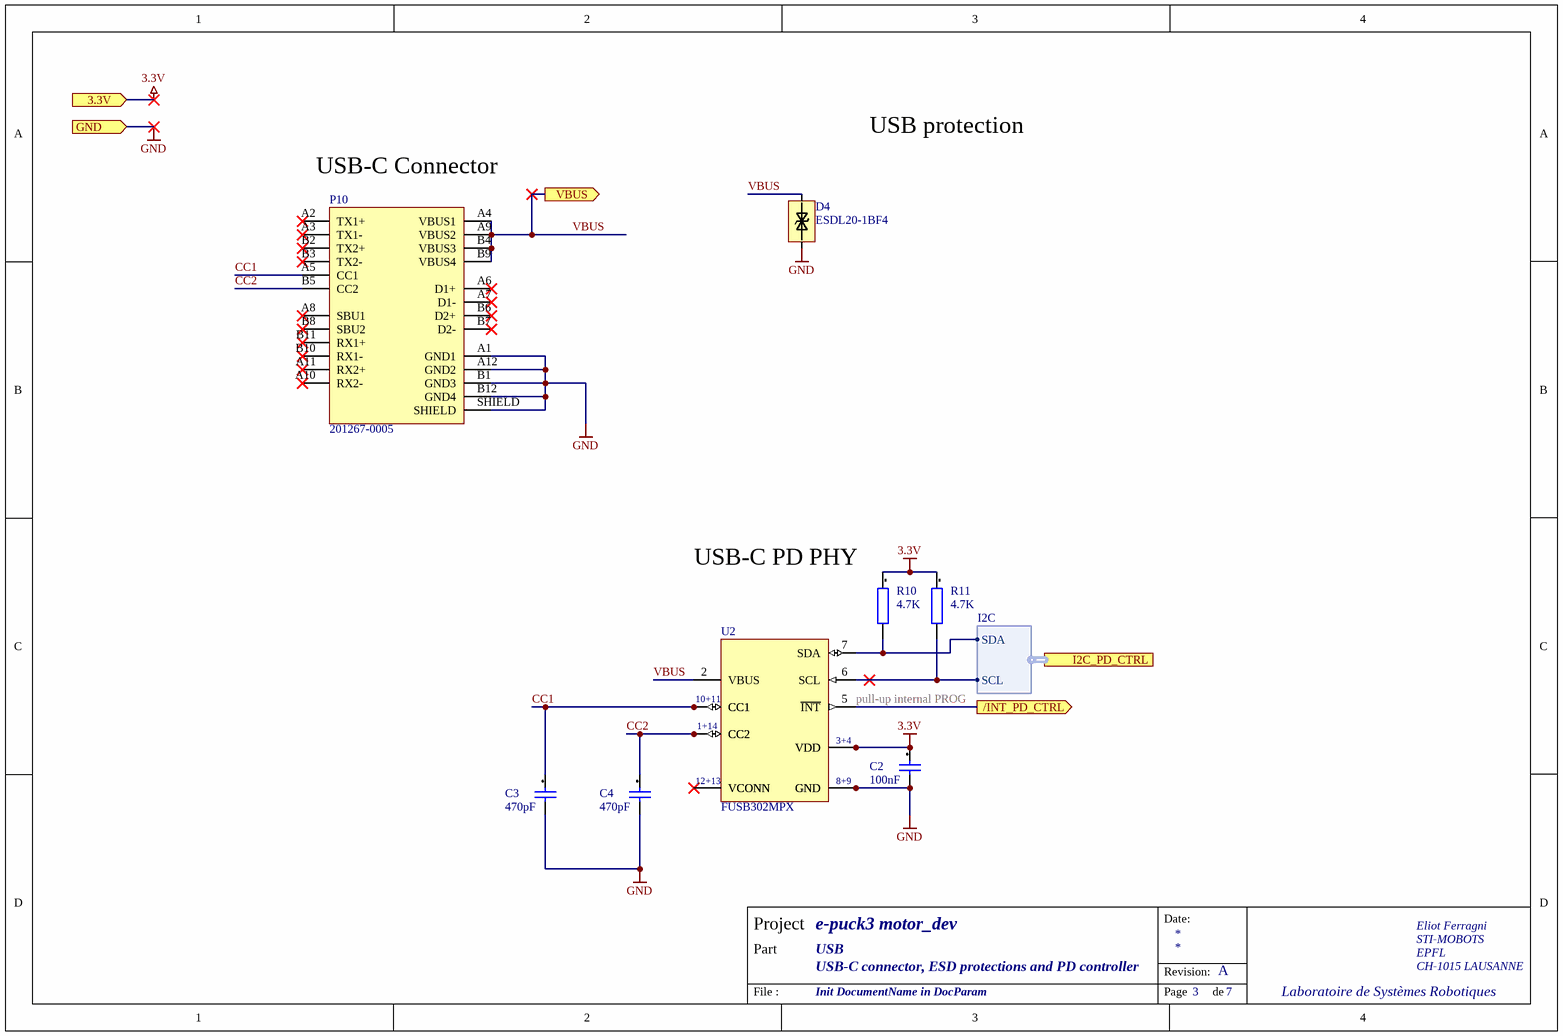
[diagram p3: USB.SchDoc]

### Parts
C2  100nF  [CAPC1608X08L]
C3  470pF  [CAPC1608X08L]
C4  470pF  [CAPC1608X08L]
D4  ESDL20-1BF4  [0201 USB protection diodes]
P10  201267-0005  [MOLEX_2012670005]
R10  4.7K  [RESC1608X06N]
R11  4.7K  [RESC1608X06N]
U2  FUSB302MPX  [PQFN50P250X250X60_HS-15L]

### Ports
3.3V (in), /INT_PD_CTRL (out), GND (in), I2C_PD_CTRL (harness I2C), VBUS (out)

### Harnesses
I2C: SDA, SCL

### Nets
3.3V: C2.1 R10.1 R11.1 U2.3(VDD) U2.4(VDD) ; port 3.3V
GND: C2.2 C3.2 C4.2 D4.2 P10.A1(GND1) P10.A12(GND2) P10.B1(GND3) P10.B12(GND4) P10.SHIELD U2.8(GND) U2.9(GND) ; port GND
VBUS: D4.1 P10.A4(VBUS1) P10.A9(VBUS2) P10.B4(VBUS3) P10.B9(VBUS4) U2.2(VBUS) ; port VBUS
/INT_PD_CTRL: U2.5(~{INT}) ; port /INT_PD_CTRL
CC1: C3.1 P10.A5(CC1) U2.10(CC1) U2.11(CC1)  [project net CC1_3]
CC2: C4.1 P10.B5(CC2) U2.1(CC2) U2.14(CC2)  [project net CC2_3]
I2C_PD_CTRL.SCL: R11.2 U2.6(SCL) ; port I2C_PD_CTRL.SCL
I2C_PD_CTRL.SDA: R10.2 U2.7(SDA) ; port I2C_PD_CTRL.SDA
NetU2_12: U2.12(VCONN) U2.13(VCONN)

Not connected (* = marked no-connect by the designer): P10 A2(TX1+)* A3(TX1-)* A6(D1+)* A7(D1-)* A8(SBU1)* A10(RX2-)* A11(RX2+)* B2(TX2+)* B3(TX2-)* B6(D2+)* B7(D2-)* B8(SBU2)* B10(RX1-)* B11(RX1+)*

### Notes on the sheet
- (near P10) USB-C Connector
- USB protection
- (near R10) USB-C PD PHY
- (near U2) pull-up internal PROG
- Date:
- Project
- Part
- Revision:
- File :
- Page
- de
- (in symbol FUSB302MPX) 10+11; 1+14; 3+4; 12+13; 8+9

### Library data of the parts
C2-C4 = TBD Capacitor[[/\]]0603[[/\]]1: as C13 on sheet Programmer; Size: 0603; Footprint Acort: 0603_G; ROHS: True; DateLastUpdate: 2012-11-19 / 14:36:40
P10 = 201267-0005: USB Shielded I/O Receptacle; Type C; Right Angle; Surface Mount; Gold over Nickel; Manufacturer: Molex; Supplier 1: Digi-Key; Stock 1: 7138; Pricing 1: 1=2.77, 10=2.531, 25=2.3876, 50=2.292, 100=2.1965, 250=2.00552, 500=1.86228 (USD); Supplier Part Number 1: WM17992CT-ND; Manufacturer Part Number: 201267-0005
R10 R11 = TBD[[/\]]0603[[/\]]1: as R12 on sheet Power; Size: 0603; Footprint Acort: 0603; ROHS: True; DateLastUpdate: 2012-11-19 / 14:13:33
U2 = FUSB302MPX: USB Type-C Port Controller 9-Pin MLP T/R; Manufacturer: ON Semiconductor / Fairchild; Operating Supply Current: 25uA; Supplier 1: Digi-Key; Stock 1: 0; Mount: Surface Mount; Number of Pins: 14; Contact Plating: Copper,Silver,Tin; Min Operating Temperature: -40°C; Max Operating Temperature: 85°C; Packaging: Tape and Reel; Interface: USB; Lead Free: Lead Free; Supplier Part Number 1: FUSB302MPXTR-ND; Manufacturer Part Number: FUSB302MPX

## Sheet Leds.SchDoc: RGB LEDs
size A4; Organization: Use Organization_Name in ProjParam; Address1: Eliot Ferragni; Address2: STI-MOBOTS; Address3: EPFL; Address4: CH-1015 LAUSANNE; DocumentNumber: 2; Revision: A; SheetNumber: 2; SheetTotal: 7; ApprovedBy: Init ApprovedBy in DocParam; CheckedBy: Init CheckedBy in DocParam; Author: Init Author in DocParam; CompanyName: Init CompanyName in DocParam; DrawnBy: Init DrawBy in DocParam; Engineer: Init Engineer in DocParam; DocumentName: Init DocumentName in DocParam; ProjectName: Init ProjectName in DocParam
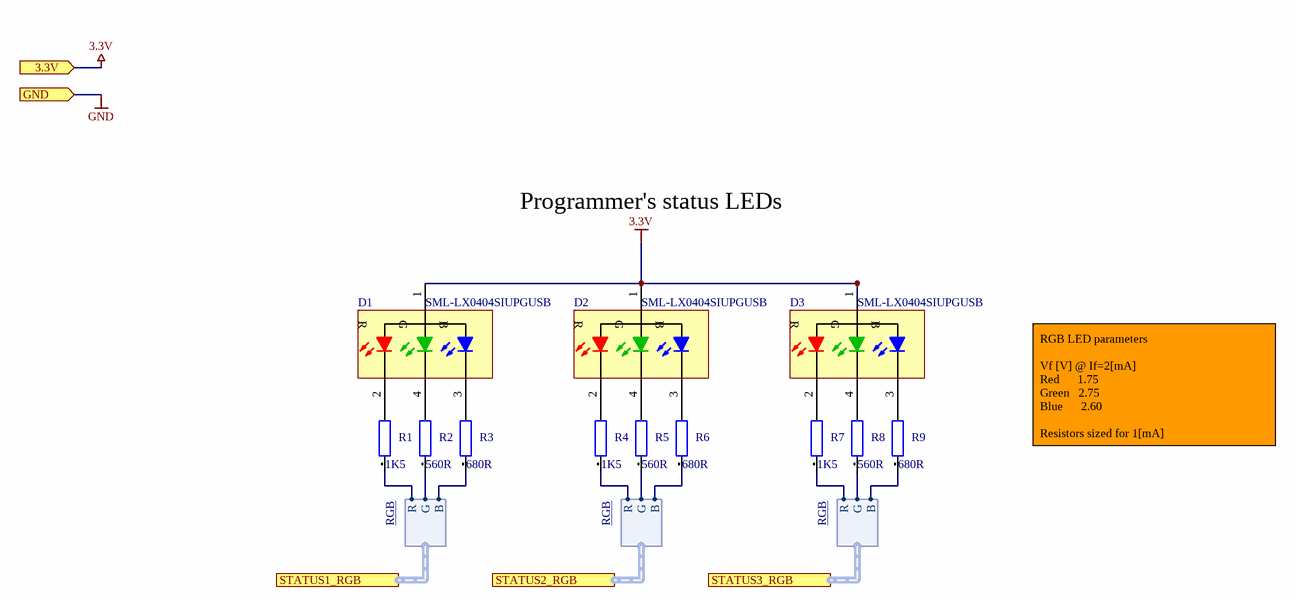
[diagram p4: Leds.SchDoc]

### Parts
D1  SML-LX0404SIUPGUSB  [LUMEX_SML-LX0404SIUPGUSB]
D2  SML-LX0404SIUPGUSB  [LUMEX_SML-LX0404SIUPGUSB]
D3  SML-LX0404SIUPGUSB  [LUMEX_SML-LX0404SIUPGUSB]
R1  1K5  [RESC1608X06N]
R2  560R  [RESC1608X06N]
R3  680R  [RESC1608X06N]
R4  1K5  [RESC1608X06N]
R5  560R  [RESC1608X06N]
R6  680R  [RESC1608X06N]
R7  1K5  [RESC1608X06N]
R8  560R  [RESC1608X06N]
R9  680R  [RESC1608X06N]

### Ports
3.3V (in), GND (in), STATUS1_RGB (harness RGB), STATUS2_RGB (harness RGB), STATUS3_RGB (harness RGB)

### Harnesses
RGB: R, G, B

### Nets
3.3V: D1.1(AC) D2.1(AC) D3.1(AC) ; port 3.3V
STATUS1_RGB.B: R3.1 ; port STATUS1_RGB.B
STATUS1_RGB.G: R2.1 ; port STATUS1_RGB.G
STATUS1_RGB.R: R1.1 ; port STATUS1_RGB.R
STATUS2_RGB.B: R6.1 ; port STATUS2_RGB.B
STATUS2_RGB.G: R5.1 ; port STATUS2_RGB.G
STATUS2_RGB.R: R4.1 ; port STATUS2_RGB.R
STATUS3_RGB.B: R9.1 ; port STATUS3_RGB.B
STATUS3_RGB.G: R8.1 ; port STATUS3_RGB.G
STATUS3_RGB.R: R7.1 ; port STATUS3_RGB.R
NetD1_2: D1.2(RC) R1.2
NetD1_3: D1.3(BC) R3.2
NetD1_4: D1.4(GC) R2.2
NetD2_2: D2.2(RC) R4.2
NetD2_3: D2.3(BC) R6.2
NetD2_4: D2.4(GC) R5.2
NetD3_2: D3.2(RC) R7.2
NetD3_3: D3.3(BC) R9.2
NetD3_4: D3.4(GC) R8.2

### Notes on the sheet
- Programmer's status LEDs
- RGB LED parameters
  Vf [V] @ If=2[mA]
  Red      1.75
  Green   2.75
  Blue      2.60
  Resistors sized for 1[mA]
- Date:
- Project
- Part
- Revision:
- File :
- Page
- de
- (in symbol LED-RGB-C243-A1) R; G; B

### Library data of the parts
D1-D3 = LED-RGB-C243-A1: QuasarBrite LED RGB (Full color 0404 SMD LED), 3x 2mA; Manufacturer: Lumex; Preference: 1; Currentie: CHF; Size: 0404; Footprint Acort: ToDefine; ComponentLink1URL: http://www.lumex.com/en/products/detail/leds7/surface_mount4/0404_package/; ComponentLink1Description: Manufacturer link; Supplier 1: Mouser; Supplier Part Number 1: 696-LX0404SIUPGUSB; ComponentLink2Description: Supplier link; ComponentLink2URL: http://www.mouser.ch/ProductDetail/Lumex/SML-LX0404SIUPGUSB/?qs=%2fha2pyFaduhVJD5ZRhDg%2ft7CXH9HmwqzW0VFa3tCuDCfVLKu7L8ofw8YssAqq7i9; Manufacturer Nr: SML-LX0404SIUPGUSB; ROHS: True; DateLastUpdate: 2015-06-26 / 09:49:20
R1-R9 = TBD[[/\]]0603[[/\]]1: as R12 on sheet Power; Size: 0603; Footprint Acort: 0603; ROHS: True; DateLastUpdate: 2012-11-19 / 14:13:33

## Sheet Encoders.SchDoc: Encoders
size A4 portrait; Organization: Use Organization_Name in ProjParam; Address1: Eliot Ferragni; Address2: STI-MOBOTS; Address3: EPFL; Address4: CH-1015 LAUSANNE; DocumentNumber: 7; Revision: A; SheetNumber: 7; SheetTotal: 7; ApprovedBy: Init ApprovedBy in DocParam; CheckedBy: Init CheckedBy in DocParam; Author: Init Author in DocParam; CompanyName: Init CompanyName in DocParam; DrawnBy: Init DrawBy in DocParam; Engineer: Init Engineer in DocParam; DocumentName: Init DocumentName in DocParam; ProjectName: Init ProjectName in DocParam
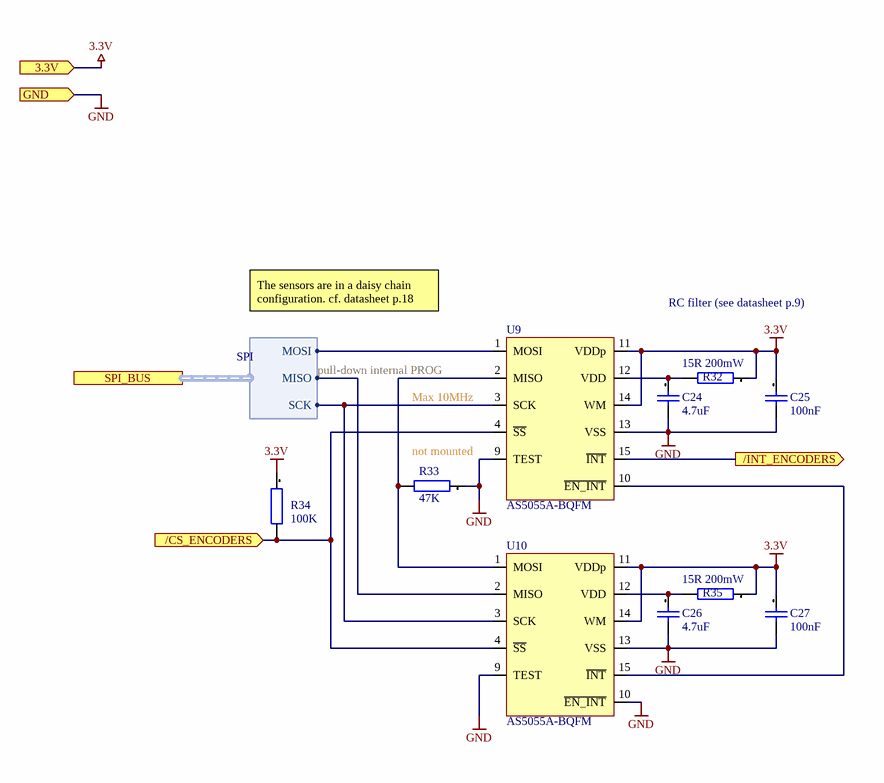
[diagram p5: Encoders.SchDoc]

### Parts
C24  4.7uF  [CAPC1608X08L]
C25  100nF  [CAPC1608X08L]
C26  4.7uF  [CAPC1608X08L]
C27  100nF  [CAPC1608X08L]
R32  15R 200mW  [RESC1608X06N]
R33  47K  [RESC1608X06N]
R34  100K  [RESC1608X06N]
R35  15R 200mW  [RESC1608X06N]
U9  AS5055A-BQFM  [QFN4X4-16 - EPAD unconnected]
U10  AS5055A-BQFM  [QFN4X4-16 - EPAD unconnected]

### Ports
3.3V (in), /CS_ENCODERS (in), /INT_ENCODERS (out), GND (in), SPI_BUS (harness SPI)

### Harnesses
SPI: MISO, MOSI, SCK

### Nets
3.3V: C25.1 C27.1 R32.1 R34.1 R35.1 U9.11(VDDp) U9.14(WM) U10.11(VDDp) U10.14(WM) ; port 3.3V
GND: C24.2 C25.2 C26.2 C27.2 R33.1 U9.9(TEST) U9.13(VSS) U10.9(TEST) U10.10(~{EN_INT}) U10.13(VSS) ; port GND
/CS_ENCODERS: R34.2 U9.4(~{SS}) U10.4(~{SS}) ; port /CS_ENCODERS
/INT_ENCODERS: U9.15(~{INT}) ; port /INT_ENCODERS
SPI_BUS.MISO: U10.2(MISO) ; port SPI_BUS.MISO
SPI_BUS.MOSI: U9.1(MOSI) ; port SPI_BUS.MOSI
SPI_BUS.SCK: U9.3(SCK) U10.3(SCK) ; port SPI_BUS.SCK
NetC24_1: C24.1 R32.2 U9.12(VDD)
NetC26_1: C26.1 R35.2 U10.12(VDD)
NetR33_2: R33.2 U9.2(MISO) U10.1(MOSI)
NetU9_10: U9.10(~{EN_INT}) U10.15(~{INT})

### Notes on the sheet
- The sensors are in a daisy chain configuration. cf. datasheet p.18
- RC filter (see datasheet p.9)
- (near U9) pull-down internal PROG
- (near U9) Max 10MHz
- not mounted
- Date:
- Project
- Part
- Revision:
- File :
- Page
- de

### Library data of the parts
C24-C27 = TBD Capacitor[[/\]]0603[[/\]]1: as C13 on sheet Programmer; Size: 0603; Footprint Acort: 0603_G; ROHS: True; DateLastUpdate: 2012-11-19 / 14:36:40
R32-R35 = TBD[[/\]]0603[[/\]]1: as R12 on sheet Power; Size: 0603; Footprint Acort: 0603; ROHS: True; DateLastUpdate: 2012-11-19 / 14:13:33
U9 U10 = AS5055A-BQFM: IC ENCODER ROTARY 12BIT 16QFN; Manufacturer: ams; Statut de la pièce: Actif; Pour la mesure: Angle; Technologie: Effet Hall; Angle de rotation - Électrique, mécanique: 0° ~ 360°, Modes continue; Sortie: SPI; Type d’actionneur: Aimant externe, non inclus; Linéarité: ±1,41°; Alimentation en tension: 3 V ~ 3,6 V; Type de montage: Montage en surface; Style de terminaison: Languette CMS (SMT); Température d’utilisation: -40°C ~ 85°C; Supplier 1: Digi-Key; RoHS: RoHS Compliant; Category: Capteurs, transducteurs; Stock 1: 6192; Pricing 1: 1=6.54, 10=5.885, 25=5.362, 100=4.8388, 250=4.44644 (EUR); Plage linéaire: -; Signal de sortie: -; Résistance (Ohms): -; Tolérance de résistance: -; ComponentLink1URL: http://ams.com/eng/content/download/552323/1541717/300455; ComponentLink1Description: http://ams.com/eng/content/download/552323/1541717/300455; Supplier 2: RSComponents; Manufacturer Part Number: AS5055A-BQFM; Supplier Part Number 1: AS5055A-BQFMCT-ND; Supplier Part Number 2: 423478

## Sheet ESC_2S-5S.SchDoc: H-Bridge and Gate driver
size A4; Organization: Use Organization_Name in ProjParam; Address1: Eliot Ferragni; Address2: STI-MOBOTS; Address3: EPFL; Address4: CH-1015 LAUSANNE; DocumentNumber: 6; Revision: A; SheetNumber: 6; SheetTotal: 7; ApprovedBy: Init ApprovedBy in DocParam; CheckedBy: Init CheckedBy in DocParam; Author: Init Author in DocParam; CompanyName: Init CompanyName in DocParam; DrawnBy: Init DrawBy in DocParam; Engineer: Init Engineer in DocParam; DocumentName: Init DocumentName in DocParam; ProjectName: Init ProjectName in DocParam
Used 4 times, as channels U1_ESC_2S-5S, U2_ESC_2S-5S, U3_ESC_2S-5S, U4_ESC_2S-5S. Parts and nets are listed once, with the designators drawn on the sheet.
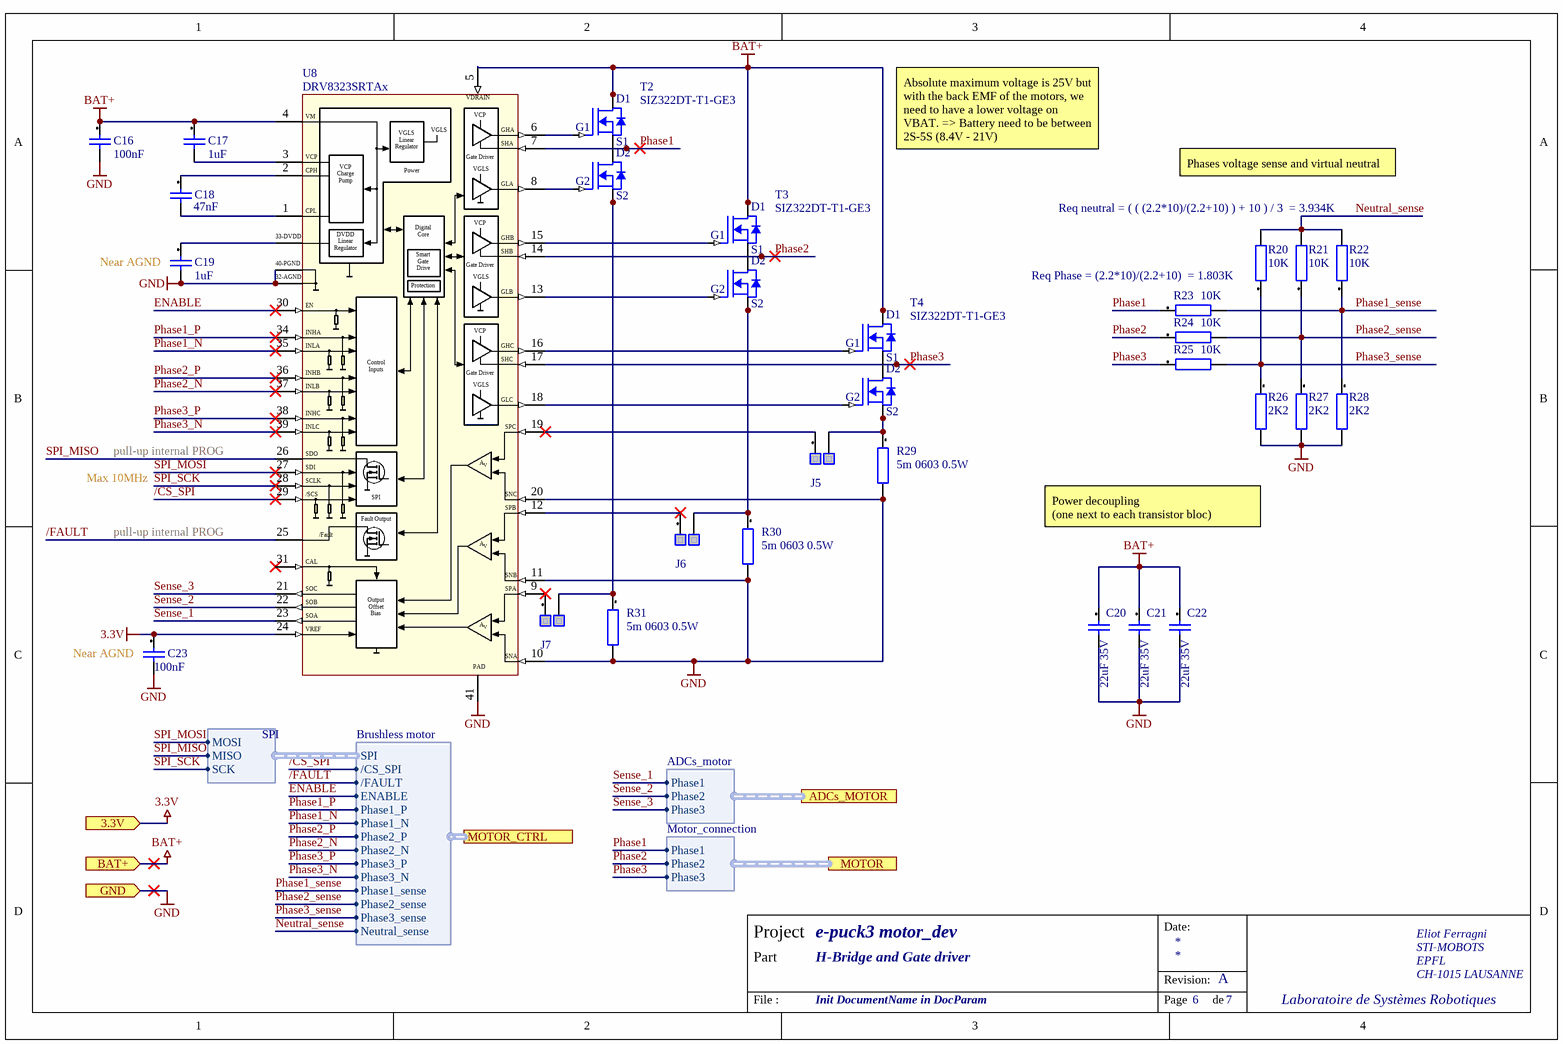
[diagram p6: ESC_2S-5S.SchDoc]

### Parts
C16  100nF  [CAPC1608X08L]
C17  1uF  [CAPC1608X08L]
C18  47nF  [CAPC1608X08L]
C19  1uF  [CAPC1608X08L]
C20  22uF 35V  [CAPC3216X17L]
C21  22uF 35V  [CAPC3216X17L]
C22  22uF 35V  [CAPC3216X17L]
C23  100nF  [CAPC1608X08L]
J5  CC_SolderJP2_Medium  [CC_SolderJP_M]  (value not drawn)  (no BOM)
J6  CC_SolderJP2_Medium  [CC_SolderJP_M]  (value not drawn)  (no BOM)
J7  CC_SolderJP2_Medium  [CC_SolderJP_M]  (value not drawn)  (no BOM)
R20  10K  [RESC1608X06N]
R21  10K  [RESC1608X06N]
R22  10K  [RESC1608X06N]
R23  10K  [RESC1608X06N]
R24  10K  [RESC1608X06N]
R25  10K  [RESC1608X06N]
R26  2K2  [RESC1608X06N]
R27  2K2  [RESC1608X06N]
R28  2K2  [RESC1608X06N]
R29  5m 0603 0.5W  [RESC1608X06L]
R30  5m 0603 0.5W  [RESC1608X06L]
R31  5m 0603 0.5W  [RESC1608X06L]
T2  SIZ322DT-T1-GE3  [PowerPair 3x3]
T3  SIZ322DT-T1-GE3  [PowerPair 3x3]
T4  SIZ322DT-T1-GE3  [PowerPair 3x3]
U8  DRV8323SRTAx  [RTA0040B_NV]

### Ports
3.3V (in), ADCs_MOTOR (harness ADCs_motor), BAT+ (in), GND (in), MOTOR (harness Motor_connection), MOTOR_CTRL (harness Brushless motor)

### Harnesses
Motor_connection: Phase1, Phase2, Phase3
SPI: MISO, MOSI, SCK
ADCs_motor: Phase1, Phase2, Phase3
Brushless motor: Phase1_P, Phase1_N, Phase2_P, Phase2_N, Phase3_P, Phase3_N, Phase1_sense, Phase2_sense, Phase3_sense, Neutral_sense, /CS_SPI, SPI, ENABLE, /FAULT

### Nets
3.3V: C23.1 U8.24(VREF) ; port 3.3V
BAT+: C16.1 C17.1 C20.1 C21.1 C22.1 T2.2(D1) T2.3(D1) T2.4(D1) T2.10(D1) T3.2(D1) T3.3(D1) T3.4(D1) T3.10(D1) T4.2(D1) T4.3(D1) T4.4(D1) T4.10(D1) U8.4(VM) U8.5(VDRAIN) ; port BAT+
GND: C16.2 C19.2 C20.2 C21.2 C22.2 C23.2 R26.2 R27.2 R28.2 R29.2 R30.2 R31.2 U8.10(SNA) U8.11(SNB) U8.20(SNC) U8.32(AGND) U8.40(PGND) U8.41(PAD) ; port GND
/CS_SPI: U8.29(GAIN_SCS_N) ; port MOTOR_CTRL./CS_SPI
/FAULT: U8.25(FAULT_N) ; port MOTOR_CTRL./FAULT
ENABLE: U8.30(ENABLE) ; port MOTOR_CTRL.ENABLE
Neutral_sense: R20.2 R21.2 R22.2 ; port MOTOR_CTRL.Neutral_sense
Phase1: R23.1 T2.9(S1/D2) U8.7(SHA) ; port MOTOR.Phase1
Phase1_N: U8.35(INLA) ; port MOTOR_CTRL.Phase1_N
Phase1_P: U8.34(INHA) ; port MOTOR_CTRL.Phase1_P
Phase1_sense: R22.1 R23.2 R28.1 ; port MOTOR_CTRL.Phase1_sense
Phase2: R24.1 T3.9(S1/D2) U8.14(SHB) ; port MOTOR.Phase2
Phase2_N: U8.37(INLB) ; port MOTOR_CTRL.Phase2_N
Phase2_P: U8.36(INHB) ; port MOTOR_CTRL.Phase2_P
Phase2_sense: R21.1 R24.2 R27.1 ; port MOTOR_CTRL.Phase2_sense
Phase3: R25.1 T4.9(S1/D2) U8.17(SHC) ; port MOTOR.Phase3
Phase3_N: U8.39(INLC) ; port MOTOR_CTRL.Phase3_N
Phase3_P: U8.38(INHC) ; port MOTOR_CTRL.Phase3_P
Phase3_sense: R20.1 R25.2 R26.1 ; port MOTOR_CTRL.Phase3_sense
Sense_1: U8.23(SOA) ; port ADCs_MOTOR.Phase1
Sense_2: U8.22(SOB) ; port ADCs_MOTOR.Phase2
Sense_3: U8.21(SOC) ; port ADCs_MOTOR.Phase3
SPI_MISO: U8.26(MODE_SDO) ; harness SPI.MISO
SPI_MOSI: U8.27(IDRIVE_SDI) ; harness SPI.MOSI
SPI_SCK: U8.28(VDS_SCLK) ; harness SPI.SCK
NetC17_2: C17.2 U8.3(VCP)
NetC18_1: C18.1 U8.2(CPH)
NetC18_2: C18.2 U8.1(CPL)
NetC19_1: C19.1 U8.33(DVDD)
NetJ5_1: J5.1 U8.19(SPC)
NetJ5_2: J5.2 R29.1 T4.5(S2) T4.6(S2) T4.7(S2)
NetJ6_1: J6.1 U8.12(SPB)
NetJ6_2: J6.2 R30.1 T3.5(S2) T3.6(S2) T3.7(S2)
NetJ7_1: J7.1 U8.9(SPA)
NetJ7_2: J7.2 R31.1 T2.5(S2) T2.6(S2) T2.7(S2)
NetT2_1: T2.1(G1) U8.6(GHA)
NetT2_8: T2.8(G2) U8.8(GLA)
NetT3_1: T3.1(G1) U8.15(GHB)
NetT3_8: T3.8(G2) U8.13(GLB)
NetT4_1: T4.1(G1) U8.16(GHC)
NetT4_8: T4.8(G2) U8.18(GLC)

Not connected (* = marked no-connect by the designer): U8 31(CAL)*

### Channels
U1_ESC_2S-5S: designators end in _1; ports 3.3V=3.3V BAT+=BAT+ GND=GND
U2_ESC_2S-5S: designators end in _2; ports 3.3V=3.3V BAT+=BAT+ GND=GND
U3_ESC_2S-5S: designators end in _3; ports 3.3V=3.3V BAT+=BAT+ GND=GND
U4_ESC_2S-5S: designators end in _4; ports 3.3V=3.3V BAT+=BAT+ GND=GND

### Notes on the sheet
- Absolute maximum voltage is 25V but with the back EMF of the motors, we need to have a lower voltage on VBAT. => Battery need to be between 2S-5S (8.4V - 21V)
- Phases voltage sense and virtual neutral voltage sense
- Req neutral = ( ( (2.2*10)/(2.2+10) ) + 10 ) / 3  = 3.934K
- (near C19) Near AGND
- (near R20) Req Phase = (2.2*10)/(2.2+10)  = 1.803K
- pull-up internal PROG
- Max 10MHz
- Power decoupling
  (one next to each transistor bloc)
- (near C23) Near AGND
- Date:
- Project
- Part
- Revision:
- File :
- Page
- de
- (in symbol DRV8323SRTAx) VGLS; / VGLS / Linear / Regulator; Gate Driver; Power; / VCP / Charge / Pump; 33-DVDD; DVDD / Linear / Regulator; 40-PGND; Smart / Gate / Drive; 32-AGND; Protection; / Digital / Core; EN; / Control / Inputs; SDO; A; SDI; V; SCLK; /SCS; / SPI; /Fault; Fault Output; / Output / Offset / Bias
- (in symbol SIZ322DT-T1-GE3) S1; D2

### Library data of the parts
C16-C19 C23 = TBD Capacitor[[/\]]0603[[/\]]1: as C13 on sheet Programmer; Size: 0603; Footprint Acort: 0603_G; ROHS: True; DateLastUpdate: 2012-11-19 / 14:36:40
C20-C22 = TBD Capacitor[[/\]]1206[[/\]]1: as C8 on sheet Power; Size: 1206; Footprint Acort: 1206; ROHS: True; DateLastUpdate: 2012-11-19 / 14:37:26
J5-J7 = CC_SolderJP2_Medium: Medium Solder Jumper 2 leads; Preference: 1; Footprint Acort: ToDefine; DateLastUpdate: 2007-11-06 / 20:24:14
R20-R28 = TBD[[/\]]0603[[/\]]1: as R12 on sheet Power; Size: 0603; Footprint Acort: 0603; ROHS: True; DateLastUpdate: 2012-11-19 / 14:13:33
R29-R31 = TBD[[/\]]0603[[/\]]1: MFC0603-R005FT5; Preference: 1; Currentie: CHF; Size: 0603; Footprint Acort: 0603; ROHS: True; DateLastUpdate: 2012-11-19 / 14:13:33
T2-T4 = SIZ322DT-T1-GE3: Manufacturer: Vishay Siliconix; Supplier 1: Digi-Key; Stock 1: 0; Pricing 1: 3000=0.37036 (USD); Supplier Part Number 1: SIZ322DT-T1-GE3TR-ND; Manufacturer Part Number: SIZ322DT-T1-GE3
U8 = DRV8323SRTAx: 6 to 60-V Three-Phase Smart Gate Driver, 3 current sense amplifiers, SPI interface, 6 x 6 × 0.75 mm QFN; Manufacturer: Texas Instruments; PartNumber: DRV8323HRTAR; RefDes: RefDes; Type: DEV; Value: Value